# Altium project CANDLE-01.PrjPcb
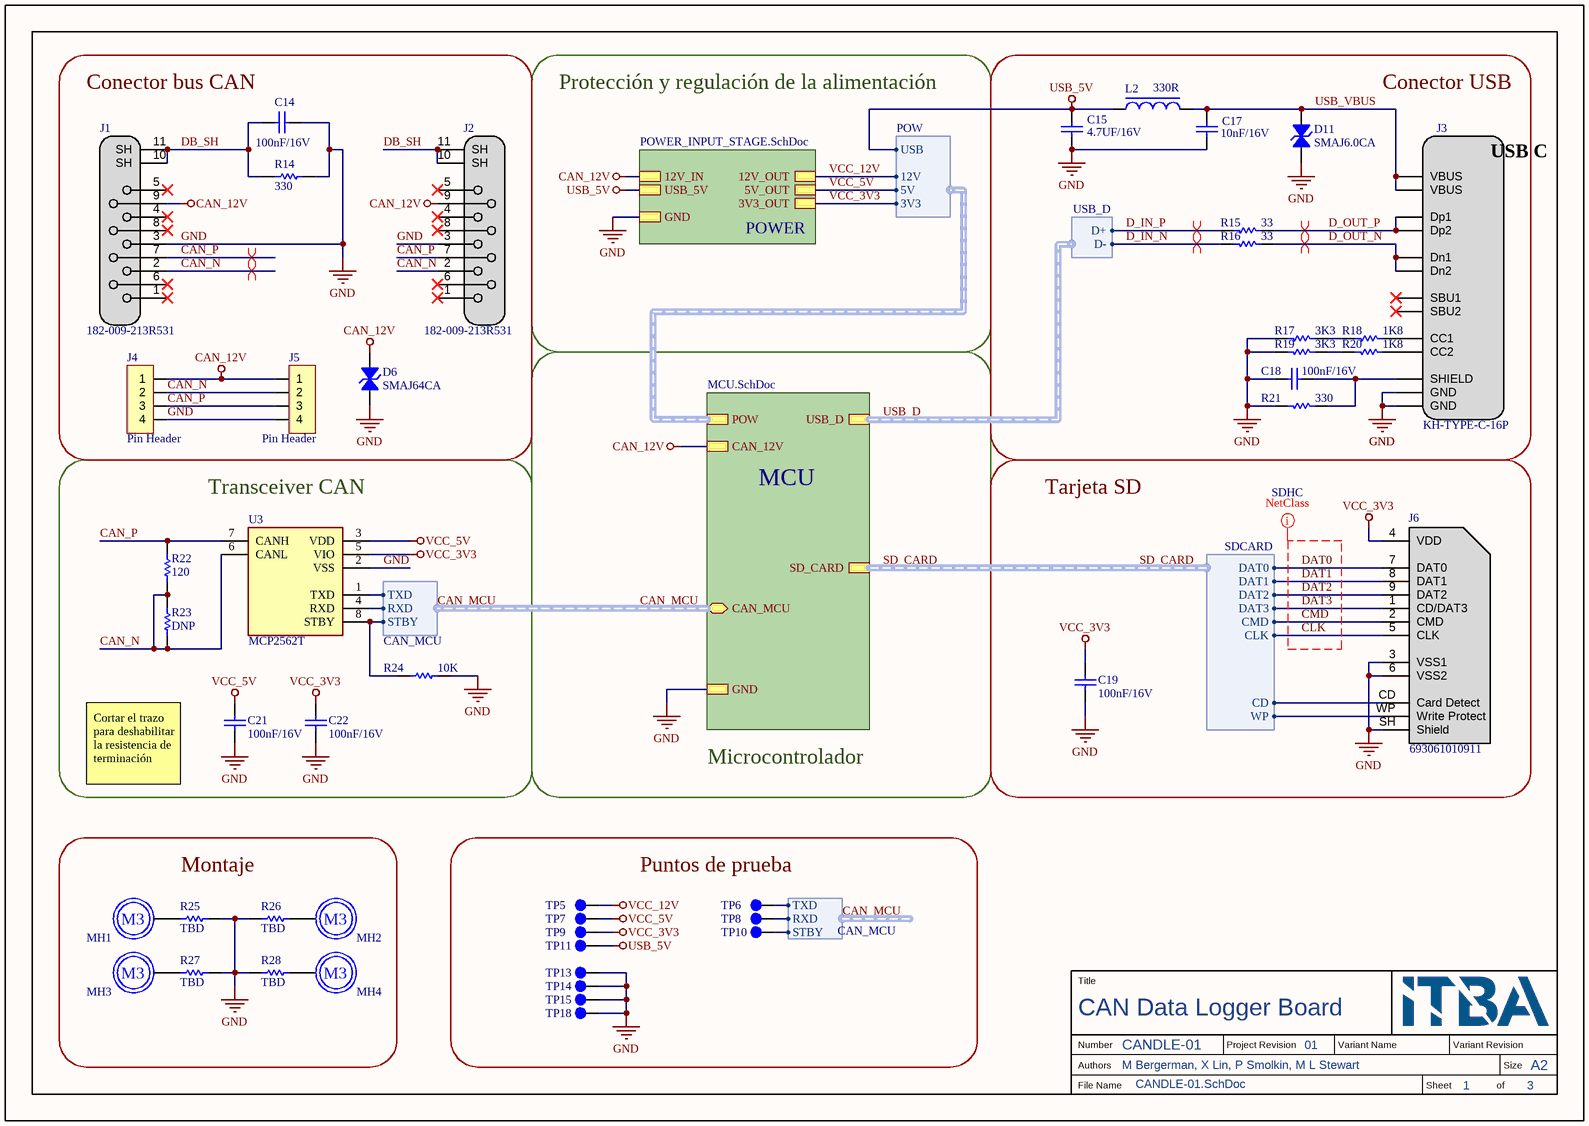
[diagram p0: CANDLE-01.SchDoc]
Authors: M Bergerman, X Lin, P Smolkin, M L Stewart; ProjectNumber: CANDLE-01; ProjectRevision: 01; ProjectTitle: CAN Data Logger Board
3 sheets, 134 parts. Net scope: strictly hierarchical (ports join the sheet entries above them; power ports are local).
Board file: CANDLE-01.PcbDoc
Sheets:
  CANDLE-01.SchDoc
    POWER = POWER_INPUT_STAGE.SchDoc
    MCU = MCU.SchDoc

## Sheet CANDLE-01.SchDoc
size 297 x 209 mm; SheetNumber: 1; SheetTotal: 3

### Parts
C14  100nF/16V  [CAP0805]
C15  4.7UF/16V  [CAP0805]
C17  10nF/16V  [CAP0805]
C18  100nF/16V  [CAP0805]
C19  100nF/16V  [CAP0805]
C21  100nF/16V  [CAP0805]
C22  100nF/16V  [CAP0805]
D6  SMAJ64CA  [DO-214AC]
D11  SMAJ6.0CA  [DO-214AC]
J1  182-009-213R531  [DE-9 - Female]
J2  182-009-213R531  [DE-9 - Female]
J3  KH-TYPE-C-16P  [USB4105-GF-A-060]
J4  Pin Header  [HEADER-4]
J5  Pin Header  [HEADER-4]
J6  693061010911  [SD CARD CONNECTOR]
L2  330R  [RES0805]
MH1  M3 Mount Hole  [M3_MOUNTING_HOLE]  (value not drawn)  (no BOM)
MH2  M3 Mount Hole  [M3_MOUNTING_HOLE]  (value not drawn)  (no BOM)
MH3  M3 Mount Hole  [M3_MOUNTING_HOLE]  (value not drawn)  (no BOM)
MH4  M3 Mount Hole  [M3_MOUNTING_HOLE]  (value not drawn)  (no BOM)
R14  330  [RES0805]
R15  33  [RES0805]
R16  33  [RES0805]
R17  3K3  [RES0805]
R18  1K8  [RES0805]
R19  3K3  [RES0805]
R20  1K8  [RES0805]
R21  330  [RES0805]
R22  120  [RES0805]
R23  DNP  [RES0805]  (no BOM)
R24  10K  [RES0805]
R25  TBD  [RES0805]
R26  TBD  [RES0805]
R27  TBD  [RES0805]
R28  TBD  [RES0805]
TP5  Testpoint  [TP_SMD_Ø1.0mm]  (value not drawn)  (no BOM)
TP6  Testpoint  [TP_SMD_Ø1.0mm]  (value not drawn)  (no BOM)
TP7  Testpoint  [TP_SMD_Ø1.0mm]  (value not drawn)  (no BOM)
TP8  Testpoint  [TP_SMD_Ø1.0mm]  (value not drawn)  (no BOM)
TP9  Testpoint  [TP_SMD_Ø1.0mm]  (value not drawn)  (no BOM)
TP10  Testpoint  [TP_SMD_Ø1.0mm]  (value not drawn)  (no BOM)
TP11  Testpoint  [TP_SMD_Ø1.0mm]  (value not drawn)  (no BOM)
TP13  Testpoint  [TP_SMD_Ø1.0mm]  (value not drawn)  (no BOM)
TP14  Testpoint  [TP_SMD_Ø1.0mm]  (value not drawn)  (no BOM)
TP15  Testpoint  [TP_SMD_Ø1.0mm]  (value not drawn)  (no BOM)
TP18  Testpoint  [TP_SMD_Ø1.0mm]  (value not drawn)  (no BOM)
U3  MCP2562T  [8-SOIC]

### Blocks framed on the sheet
Conector bus CAN: C14 D6 J1 J2 J4 J5 R14
Conector USB: C15 C17 C18 D11 J3 L2 R15-R21
Transceiver CAN: C21 C22 R22-R24 U3
Tarjeta SD: C19 J6
Montaje: MH1-MH4 R25-R28
Puntos de prueba: TP5-TP11 TP13-TP15 TP18

### Sub-sheets
MCU = MCU.SchDoc: USB_D (harness USB_D), SD_CARD (harness SDCARD), CAN_MCU (bidir, harness CAN_MCU), POW (harness POW), CAN_12V, GND
POWER = POWER_INPUT_STAGE.SchDoc: 12V_IN, GND, 12V_OUT, 5V_OUT, 3V3_OUT, USB_5V

### Harnesses
SDCARD: DAT0, DAT1, DAT2, DAT3, CMD, CLK, CD, WP
CAN_MCU: TXD, RXD, STBY
USB_D: D+, D-
POW: 12V, 5V, 3V3, USB

### Nets
CAN_12V: D6.2(A2) J1.9 J2.9 J4.1 J5.1 ; sheet POWER/12V_IN, sheet MCU/CAN_12V  [project net 12V_IN]
GND: C14.2 C15.1 C17.1 C18.2 C19.1 C21.1 C22.1 D6.1(A1) D11.1(A1) J1.3 J2.3 J3.A1B12(GND) J3.B1A12(GND) J4.4 J5.4 J6.3(VSS1) J6.6(VSS2) J6.SH(Shield) R14.2 R17.1 R19.1 R21.2 R24.1 R25.1 R26.2 R27.1 R28.2 TP13.1(TP) TP14.1(TP) TP15.1(TP) TP18.1(TP) U3.2(VSS) ; sheet POWER/GND, sheet MCU/GND
USB_5V: C15.2 L2.1 TP11.1(TP) ; sheet POWER/USB_5V, sheet MCU/POW.USB
VCC_3V3: C19.2 C22.2 J6.4(VDD) TP9.1(TP) U3.5(VIO) ; sheet POWER/3V3_OUT, sheet MCU/POW.3V3
VCC_5V: C21.2 TP7.1(TP) U3.3(VDD) ; sheet POWER/5V_OUT, sheet MCU/POW.5V
VCC_12V: TP5.1(TP) ; sheet POWER/12V_OUT, sheet MCU/POW.12V
CAN_MCU.RXD: TP8.1(TP) U3.4(RXD) ; sheet MCU/CAN_MCU.RXD
CAN_MCU.STBY: R24.2 TP10.1(TP) U3.8(STBY) ; sheet MCU/CAN_MCU.STBY
CAN_MCU.TXD: TP6.1(TP) U3.1(TXD) ; sheet MCU/CAN_MCU.TXD
CAN_N: J1.2 J2.2 J4.2 J5.2 R22.1 R23.1 R23.2 U3.6(CANL)
CAN_P: J1.7 J2.7 J4.3 J5.3 R22.2 U3.7(CANH)
CLK: J6.5(CLK) ; sheet MCU/SD_CARD.CLK
CMD: J6.2(CMD) ; sheet MCU/SD_CARD.CMD
D_IN_N: R16.1 ; sheet MCU/USB_D.D-
D_IN_P: R15.1 ; sheet MCU/USB_D.D+
D_OUT_N: J3.A7(Dn1) J3.B7(Dn2) R16.2
D_OUT_P: J3.A6(Dp1) J3.B6(Dp2) R15.2
DAT0: J6.7(DAT0) ; sheet MCU/SD_CARD.DAT0
DAT1: J6.8(DAT1) ; sheet MCU/SD_CARD.DAT1
DAT2: J6.9(DAT2) ; sheet MCU/SD_CARD.DAT2
DAT3: J6.1(CD/DAT3) ; sheet MCU/SD_CARD.DAT3
DB_SH: C14.1 J1.10(SH) J1.11(SH) J2.10(SH) J2.11(SH) R14.1
SD_CARD.CD: J6.CD(Card_Detect) ; sheet MCU/SD_CARD.CD
SD_CARD.WP: J6.WP(Write_Protect) ; sheet MCU/SD_CARD.WP
USB_VBUS: C17.2 D11.2(A2) J3.A4B9(VBUS) J3.B4A9(VBUS) L2.2
NetC18_1: C18.1 J3.SH(SHIELD) R21.1
NetJ3_A5: J3.A5(CC1) R18.2
NetJ3_B5: J3.B5(CC2) R20.2
NetMH1_1: MH1.1(TP) R25.2
NetMH2_1: MH2.1(TP) R26.1
NetMH3_1: MH3.1(TP) R27.2
NetMH4_1: MH4.1(TP) R28.1
NetR17_2: R17.2 R18.1
NetR19_2: R19.2 R20.1

Not connected (* = marked no-connect by the designer): J1 1* 4* 5* 6* 8*; J2 1* 4* 5* 6* 8*; J3 A8(SBU1)* B8(SBU2)*

### Buses and harness runs
harness CAN_MCU = sheet MCU/CAN_MCU
harness SD_CARD = sheet MCU/SD_CARD
harness USB_D = sheet MCU/USB_D

### Layout directives
differential pair; differential pair class CAN: CAN_N, CAN_P
differential pair; differential pair class USB: D_IN_N, D_IN_P, D_OUT_N, D_OUT_P
net class SDHC: CLK, CMD, DAT0, DAT1, DAT2, DAT3

### Notes on the sheet
- Protección y regulación de la alimentación
- Cortar el trazo para deshabilitar la resistencia de terminación
- Microcontrolador
- Title
- File Name
- Number
- Authors
- Project Revision
- Variant Name
- Sheet
- Variant Revision
- of
- Size
- A2
- (in symbol M3 Mount Hole) M3
- (in symbol USB4105-GF-A-060) USB C

### Library data of the parts
C14 C15 C17-C19 C21 C22 = Capacitor: SMD 0805 Capacitor
D6 D11 = Diode TVS: TVS Diode
J1 J2 = DE-09: Receptacle Assembly, 9 Position, Right Angle
J3 = USB4105-GF-A-060: USB Connector Type C SMT 12 Pin; Manufacturer: GCT; Manufacturer Part Number: USB4105-GF-A-060; Distributor Link: https://eu.mouser.com/ProductDetail/GCT/USB4105-GF-A-060?qs=QNEnbhJQKvY2mocwNJzgfA%3D%3D
J4 J5 = HEADER-4: Pin Header 4-pos
J6 = SD_CARD_READER: SD Card Reader
L2 = Ferrite Bead
MH1-MH4 = M3 Mount Hole: M3 Mounting Hole
R14-R28 = Resistor: SMD 0805 Resistor
U3 = MCP2562T: High-Speed CAN Transceiver

## Sheet POWER_INPUT_STAGE.SchDoc
size 297 x 209 mm; SheetNumber: 2; SheetTotal: 3; SPICEModelCacheWNYSDJRL: <root> / <DocumentId>WNYSDJRL</DocumentId> / </root>
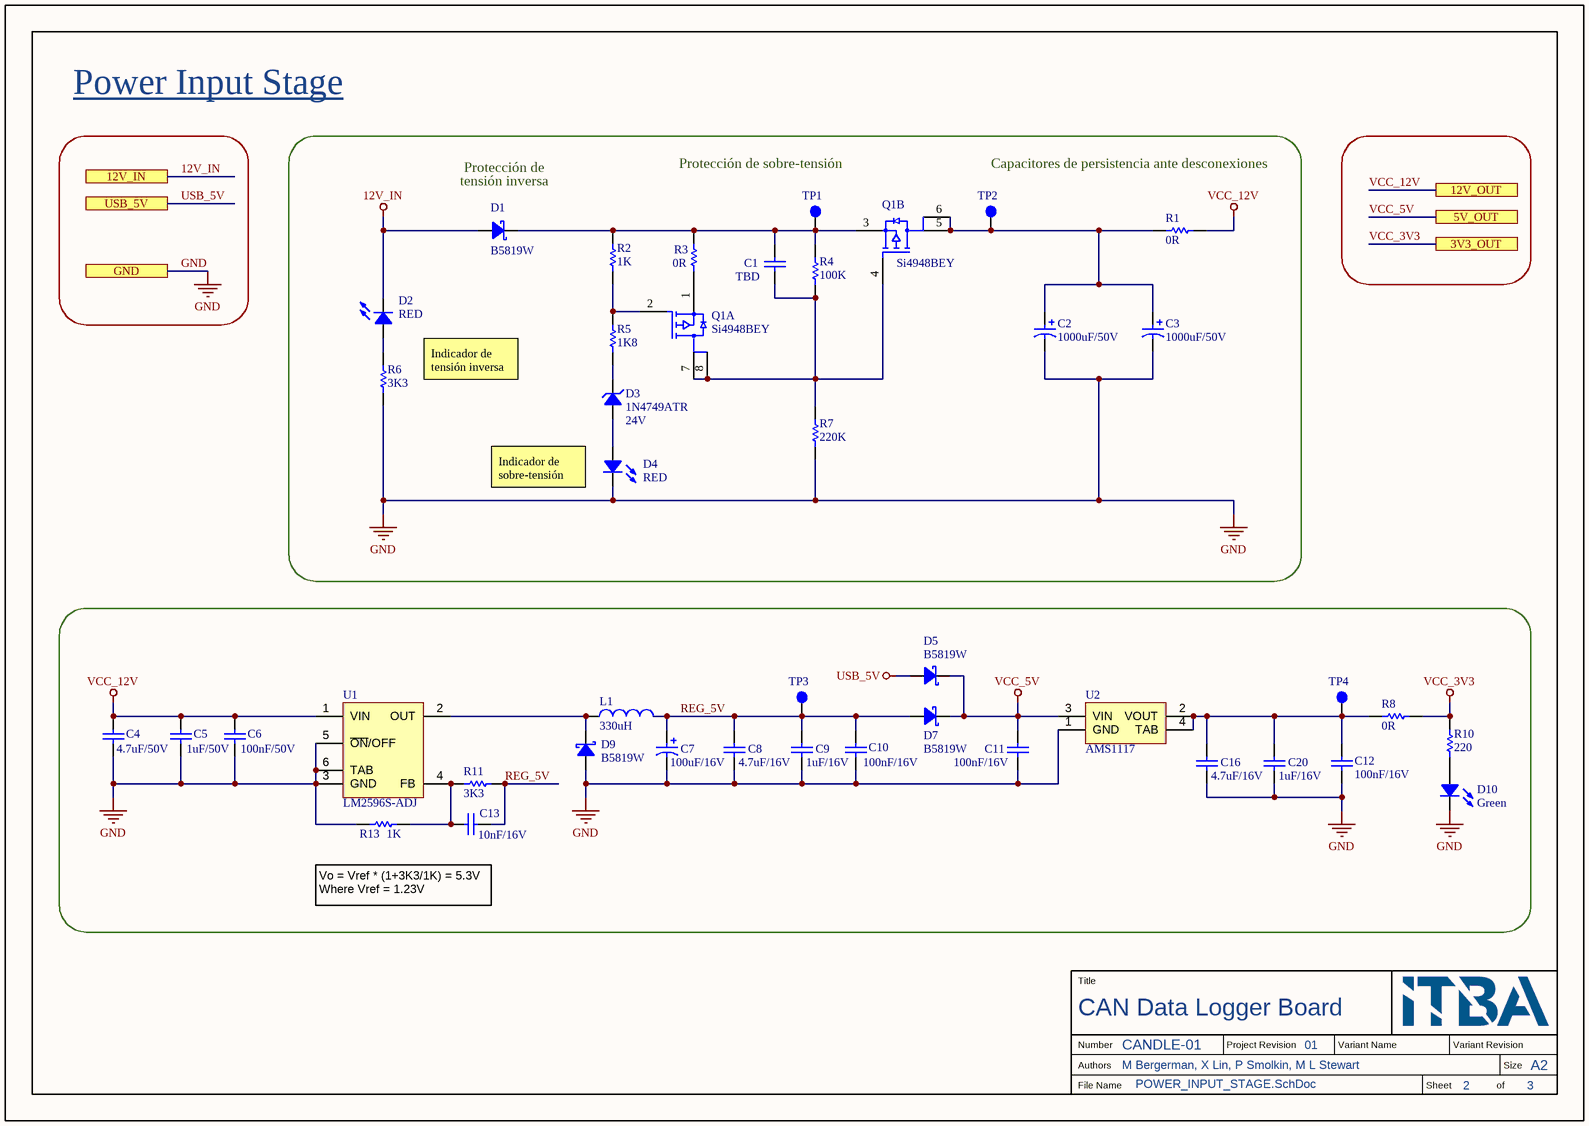
[diagram p1: POWER_INPUT_STAGE.SchDoc]

### Parts
C1  TBD  [CAP0805]
C2  1000uF/50V  [RAD-CAP-12.5/5mm]
C3  1000uF/50V  [RAD-CAP-12.5/5mm]
C4  4.7uF/50V  [CAP0805]
C5  1uF/50V  [CAP0805]
C6  100nF/50V  [CAP0805]
C7  100uF/16V  [RAD-CAP-12.5/5mm]
C8  4.7uF/16V  [CAP0805]
C9  1uF/16V  [CAP0805]
C10  100nF/16V  [CAP0805]
C11  100nF/16V  [CAP0805]
C12  100nF/16V  [CAP0805]
C13  10nF/16V  [CAP0805]
C16  4.7uF/16V  [CAP0805]
C20  1uF/16V  [CAP0805]
D1  B5819W  [SOD-123]
D2  RED  [LED-3MM-RED-RA]
D3  1N4749ATR  Voltage: 24V  [DO-35]
D4  RED  [LED-3MM-RED-RA]
D5  B5819W  [SOD-123]
D7  B5819W  [SOD-123]
D9  B5819W  [SOD-123]
D10  Green  [LED-3MM-GREEN-RA]
L1  330uH  [DRQ127-INDUCTOR]
Q1  Si4948BEY  [8-SOIC]  (parts A,B of 2)
R1  0R  [RES0805]
R2  1K  [RES0805]
R3  0R  [RES0805]
R4  100K  [RES0805]
R5  1K8  [RES0805]
R6  3K3  [RES0805]
R7  220K  [RES0805]
R8  0R  [RES0805]
R10  220  [RES0805]
R11  3K3  [RES0805]
R13  1K  [RES0805]
TP1  Testpoint  [TP_SMD_Ø1.0mm]  (value not drawn)  (no BOM)
TP2  Testpoint  [TP_SMD_Ø1.0mm]  (value not drawn)  (no BOM)
TP3  Testpoint  [TP_SMD_Ø1.0mm]  (value not drawn)  (no BOM)
TP4  Testpoint  [TP_SMD_Ø1.0mm]  (value not drawn)  (no BOM)
U1  LM2596S-ADJ  [LM2596S-ADJ/NOPB]
U2  AMS1117  [SOT223]

### Ports
3V3_OUT, 5V_OUT, 12V_IN, 12V_OUT, GND, USB_5V

### Nets
12V_IN: D1.1(A) D2.2(K) ; port 12V_IN
GND: C2.1 C3.1 C4.1 C5.1 C6.1 C7.1 C8.1 C9.1 C10.1 C11.1 C12.1 C16.1 C20.1 D4.2(K) D9.1(A) D10.2(K) R6.1 R7.1 R13.2 U1.3(GND) U1.5(~{ON}/OFF) U1.6(TAB) U2.1(GND) ; port GND
USB_5V: D5.1(A) ; port USB_5V
VCC_3V3: R8.2 R10.1 ; port 3V3_OUT
VCC_5V: C11.2 D5.2(K) D7.2(K) U2.3(VIN) ; port 5V_OUT
VCC_12V: C4.2 C5.2 C6.2 R1.2 U1.1(VIN) ; port 12V_OUT
REG_5V: C7.2 C8.2 C9.2 C10.2 C13.2 D7.1(A) L1.2 R11.1 TP3.1(TP)
NetC1_1: C1.1 Q1.4(G2) Q1.7(D1) Q1.8(D1) R4.1 R7.2
NetC1_2: C1.2 D1.2(K) Q1.3(S2) R2.2 R3.2 R4.2 TP1.1(TP)
NetC2_2: C2.2 C3.2 Q1.5(D2) Q1.6(D2) R1.1 TP2.1(TP)
NetC12_2: C12.2 C16.2 C20.2 R8.1 TP4.1(TP) U2.2(VOUT) U2.4(TAB)
NetC13_1: C13.1 R11.2 R13.1 U1.4(FB)
NetD2_1: D2.1(A) R6.2
NetD3_1: D3.1(K) R5.1
NetD3_2: D3.2(A) D4.1(A)
NetD9_2: D9.2(K) L1.1 U1.2(OUT)
NetD10_1: D10.1(A) R10.2
NetQ1_1: Q1.1(S1) R3.1
NetQ1_2: Q1.2(G1) R2.1 R5.2

### Notes on the sheet
- Power Input Stage
- Protección de
- (near D1) tensión inversa
- Protección de sobre-tensión
- Capacitores de persistencia ante desconexiones
- Indicador de tensión inversa
- (near D4) Indicador de sobre-tensión
- Vo = Vref * (1+3K3/1K) = 5.3V
  Where Vref = 1.23V
- Title
- File Name
- Number
- Authors
- Project Revision
- Variant Name
- Sheet
- Variant Revision
- of
- Size
- A2

### Library data of the parts
C1 C4-C6 C8-C13 C16 C20 = Capacitor: SMD 0805 Capacitor
C2 C3 C7 = Capacitor Polarized: Polarized Capacitor (Radial)
D1 D5 D7 D9 = Diode Schottky: Schottky Diode
D2 D4 = LED 3mm Red RA: Red 3mm LED
D3 = Diode Zener: Zener Diode
D10 = LED 3mm Green RA: Green 3mm LED
L1 = Inductor: Code_IEC: 1005; Published: 8-Jun-2000; LatestRevisionDate: 29-May-2009; LatestRevisionNote: IPC-7351 Footprint Added.; PackageReference: 0402-A; Publisher: Altium Limited; PackageDescription: Chip Inductor; Code_JEITA: 0402
Q1 = Si4948BEY: MOSFET 2P-CH 60V 2.4A 8-SOIC; Number of Elements: 2; Rise Time: 15ns; Turn-On Delay Time: 10ns; Turn-Off Delay Time: 50ns; Rds On Max: 120mR; Nominal Vgs: -3V; Polarity: P-CHANNEL; Max Power Dissipation: 1.4W; Element Configuration: Dual; Gate to Source Voltage (Vgs): 20V; Drain to Source Voltage (Vdss): -60V; Weight: 0.006596oz; Number of Pins: 8; Height: 1.55mm; Drain to Source Resistance: 120mR; Continuous Drain Current (ID): 2.4A; Packaging: Tape and Reel; On-State Resistance: 120mR; Fall Time: 15ns; Max Operating Temperature: 175°C; Drain-source On Resistance-Max: 120mR; Series: TrenchFET®; Radiation Hardening: No; Threshold Voltage: -3V; Lead Free: Lead Free; RoHS Compliant: Yes; Package Quantity: 2500; Power Dissipation: 1.4W; Min Operating Temperature: -55°C; Number of Channels: 2; Case/Package: SO; Reach SVHC Compliant: Yes; Width: 4mm; Length: 5mm; Mount: Surface Mount
R1-R8 R10 R11 R13 = Resistor: SMD 0805 Resistor
U1 = LM2596S-ADJ/NOPB: SIMPLE SWITCHER® Power Converter 150 KHz 3A Step-Down Voltage Regulator, 5-pin TO-263, Pb-Free
U2 = AMS1117: 1A LOW DROPOUT VOLTAGE REGULATOR

## Sheet MCU.SchDoc
size 297 x 209 mm; SheetNumber: 3; SheetTotal: 3; SPICEModelCacheVLKWCBOF: <root> / <DocumentId>VLKWCBOF</DocumentId> / </root>
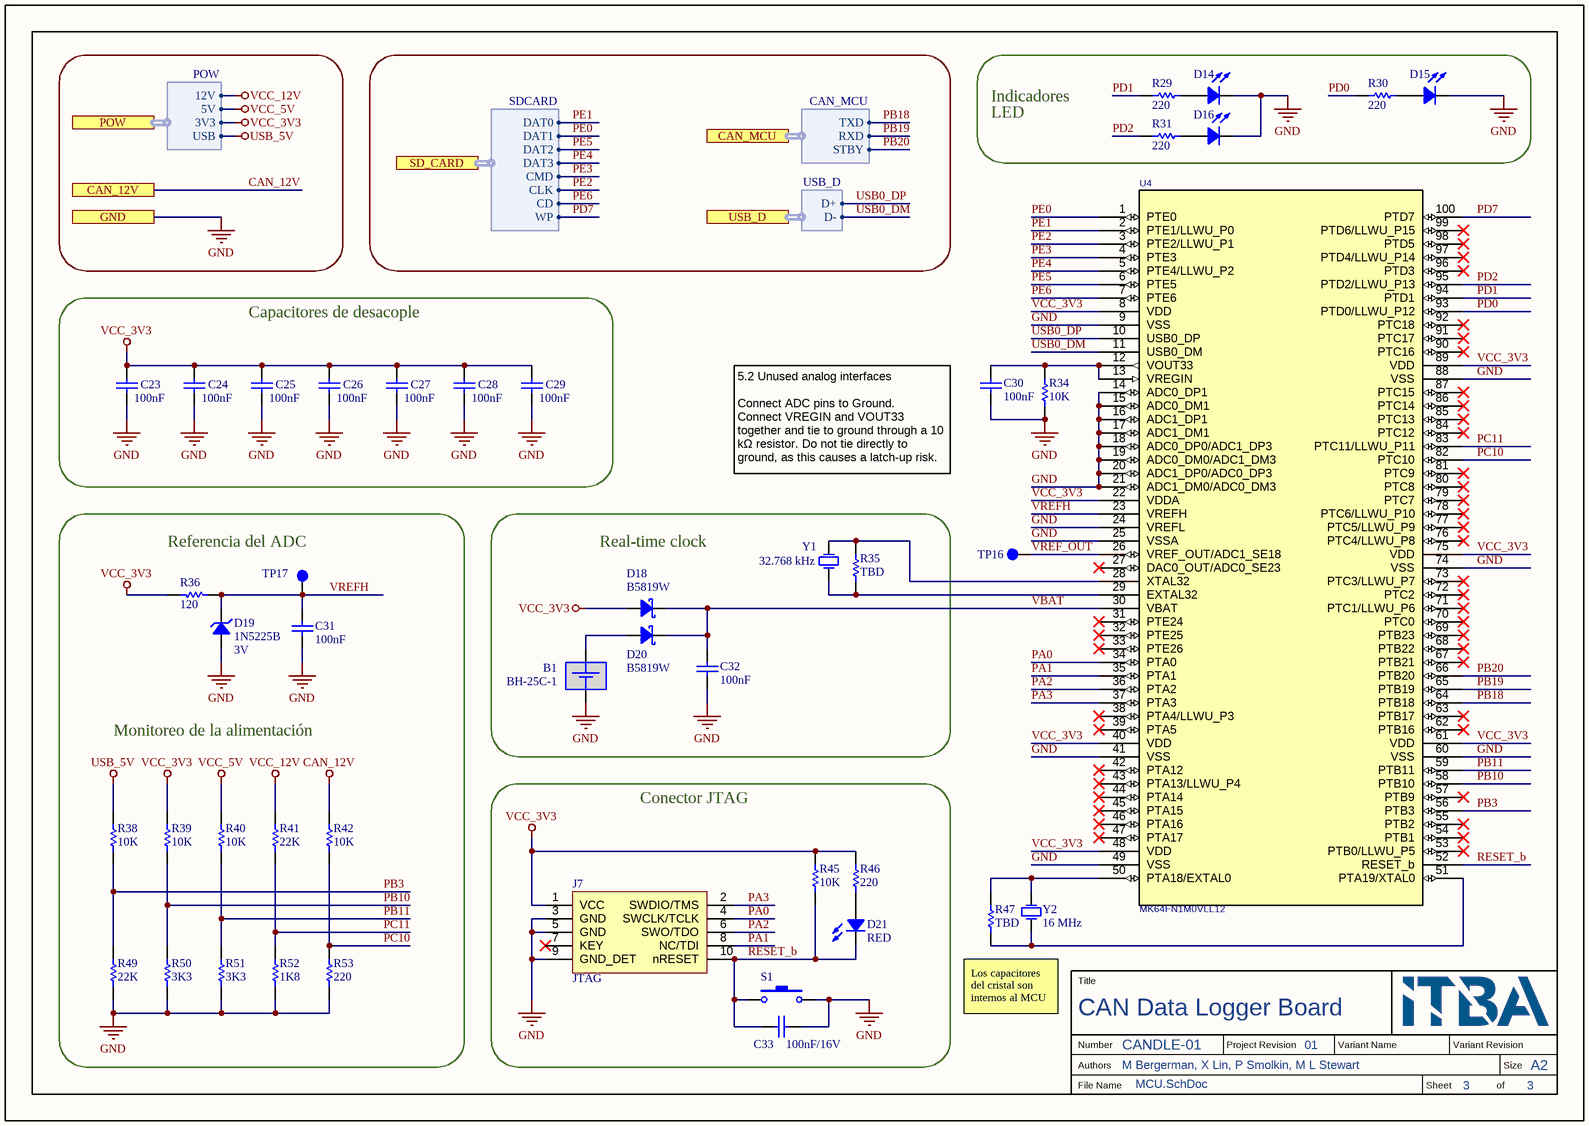
[diagram p2: MCU.SchDoc]

### Parts
B1  BH-25C-1  [COIN_CELL_HOLDER]
C23  100nF  [CAP0805]
C24  100nF  [CAP0805]
C25  100nF  [CAP0805]
C26  100nF  [CAP0805]
C27  100nF  [CAP0805]
C28  100nF  [CAP0805]
C29  100nF  [CAP0805]
C30  100nF  [CAP0805]
C31  100nF  [CAP0805]
C32  100nF  [CAP0805]
C33  100nF/16V  [CAP0805]
D14  RED  [LED-3MM-RED-RA]  (value not drawn)
D15  RED  [LED-3MM-RED-RA]  (value not drawn)
D16  RED  [LED-3MM-RED-RA]  (value not drawn)
D18  B5819W  [SOD-123]
D19  1N5225B  Voltage: 3V  [DO-35]
D20  B5819W  [SOD-123]
D21  RED  [LED-3MM-RED-RA]
J7  JTAG  [JTAG-10PIN]
R29  220  [RES0805]
R30  220  [RES0805]
R31  220  [RES0805]
R34  10K  [RES0805]
R35  TBD  [RES0805]
R36  120  [RES0805]
R38  10K  [RES0805]
R39  10K  [RES0805]
R40  10K  [RES0805]
R41  22K  [RES0805]
R42  10K  [RES0805]
R45  10K  [RES0805]
R46  220  [RES0805]
R47  TBD  [RES0805]
R49  22K  [RES0805]
R50  3K3  [RES0805]
R51  3K3  [RES0805]
R52  1K8  [RES0805]
R53  220  [RES0805]
S1  Tact Switch  [TACT SWITCH]  (value not drawn)
TP16  Testpoint  [TP_SMD_Ø1.0mm]  (value not drawn)  (no BOM)
TP17  Testpoint  [TP_SMD_Ø1.0mm]  (value not drawn)  (no BOM)
U4  MK64FN1M0VLL12  [QFP50P1600X1600X160-100N]
Y1  32.768 kHz  [XTAL-RAD-3X8]
Y2  16 MHz  [XTAL-HC-49S]

### Blocks framed on the sheet
Capacitores de desacople: C23-C29
Real-time clock: B1 C32 D18 D20 R35 Y1
Conector JTAG: C33 D21 J7 R45 R46 S1

### Ports
CAN_12V, CAN_MCU (harness CAN_MCU), GND, POW (harness POW), SD_CARD (harness SDCARD), USB_D (harness USB_D)

### Harnesses
CAN_MCU: TXD, RXD, STBY
USB_D: D+, D-
SDCARD: DAT0, DAT1, DAT2, DAT3, CMD, CLK, CD, WP
POW: 12V, 5V, 3V3, USB

### Nets
CAN_12V: R42.1 ; port CAN_12V  [project net 12V_IN]
GND: B1.2 C23.1 C24.1 C25.1 C26.1 C27.1 C28.1 C29.1 C30.1 C31.1 C32.1 C33.1 D14.2(K) D15.2(K) D16.2(K) D19.2(A) J7.3(GND) J7.5(GND) J7.9(GND_DET) R34.1 R49.2 R50.2 R51.2 R52.2 R53.2 S1.2 U4.9(VSS) U4.14(ADC0_DP1) U4.15(ADC0_DM1) U4.16(ADC1_DP1) U4.17(ADC1_DM1) U4.18(ADC0_DP0/ADC1_DP3) U4.19(ADC0_DM0/ADC1_DM3) U4.20(ADC1_DP0/ADC0_DP3) U4.21(ADC1_DM0/ADC0_DM3) U4.24(VREFL) U4.25(VSSA) U4.41(VSS) U4.49(VSS) U4.60(VSS) U4.74(VSS) U4.88(VSS) ; port GND
USB_5V: R38.1 ; port POW.USB
VCC_3V3: C23.2 C24.2 C25.2 C26.2 C27.2 C28.2 C29.2 D18.1(A) J7.1(VCC) R36.2 R39.1 R45.2 R46.1 U4.8(VDD) U4.22(VDDA) U4.40(VDD) U4.48(VDD) U4.61(VDD) U4.75(VDD) U4.89(VDD) ; port POW.3V3
VCC_5V: R40.1 ; port POW.5V
VCC_12V: R41.1 ; port POW.12V
PA0: J7.4(SWCLK/TCLK) U4.34(PTA0)
PA1: J7.8(NC/TDI) U4.35(PTA1)
PA2: J7.6(SWO/TDO) U4.36(PTA2)
PA3: J7.2(SWDIO/TMS) U4.37(PTA3)
PB3: R38.2 R49.1 U4.56(PTB3)
PB10: R39.2 R50.1 U4.58(PTB10)
PB11: R40.2 R51.1 U4.59(PTB11)
PB18: U4.64(PTB18) ; port CAN_MCU.TXD  [project net CAN_MCU.TXD]
PB19: U4.65(PTB19) ; port CAN_MCU.RXD  [project net CAN_MCU.RXD]
PB20: U4.66(PTB20) ; port CAN_MCU.STBY  [project net CAN_MCU.STBY]
PC10: R42.2 R53.1 U4.82(PTC10)
PC11: R41.2 R52.1 U4.83(PTC11/LLWU_P11)
PD0: R30.1 U4.93(PTD0/LLWU_P12)
PD1: R29.1 U4.94(PTD1)
PD2: R31.1 U4.95(PTD2/LLWU_P13)
PD7: U4.100(PTD7) ; port SD_CARD.WP  [project net SD_CARD.WP]
PE0: U4.1(PTE0) ; port SD_CARD.DAT1  [project net DAT1]
PE1: U4.2(PTE1/LLWU_P0) ; port SD_CARD.DAT0  [project net DAT0]
PE2: U4.3(PTE2/LLWU_P1) ; port SD_CARD.CLK  [project net CLK]
PE3: U4.4(PTE3) ; port SD_CARD.CMD  [project net CMD]
PE4: U4.5(PTE4/LLWU_P2) ; port SD_CARD.DAT3  [project net DAT3]
PE5: U4.6(PTE5) ; port SD_CARD.DAT2  [project net DAT2]
PE6: U4.7(PTE6) ; port SD_CARD.CD  [project net SD_CARD.CD]
RESET_b: C33.2 D21.2(K) J7.10(nRESET) R45.1 S1.1 U4.52(RESET_b)
USB0_DM: U4.11(USB0_DM) ; port USB_D.D-  [project net D_IN_N]
USB0_DP: U4.10(USB0_DP) ; port USB_D.D+  [project net D_IN_P]
VBAT: C32.2 D18.2(K) D20.2(K) U4.30(VBAT)
VREF_OUT: TP16.1(TP) U4.26(VREF_OUT/ADC1_SE18)
VREFH: C31.2 D19.1(K) R36.1 TP17.1(TP) U4.23(VREFH)
NetB1_1: B1.1 D20.1(A)
NetC30_2: C30.2 R34.2 U4.12(VOUT33) U4.13(VREGIN)
NetD14_1: D14.1(A) R29.2
NetD15_1: D15.1(A) R30.2
NetD16_1: D16.1(A) R31.2
NetD21_1: D21.1(A) R46.2
NetR35_1: R35.1 U4.28(XTAL32) Y1.2(OSC2)
NetR35_2: R35.2 U4.29(EXTAL32) Y1.1(OSC1)
NetR47_1: R47.1 U4.51(PTA19/XTAL0) Y2.1(OSC1)
NetR47_2: R47.2 U4.50(PTA18/EXTAL0) Y2.2(OSC2)

Not connected (* = marked no-connect by the designer): J7 7(KEY)*; U4 27(DAC0_OUT/ADC0_SE23)* 31(PTE24)* 32(PTE25)* 33(PTE26)* 38(PTA4/LLWU_P3)* 39(PTA5)* 42(PTA12)* 43(PTA13/LLWU_P4)* 44(PTA14)* 45(PTA15)* 46(PTA16)* 47(PTA17)* 53(PTB0/LLWU_P5)* 54(PTB1)* 55(PTB2)* 57(PTB9)* 62(PTB16)* 63(PTB17)* 67(PTB21)* 68(PTB22)* 69(PTB23)* 70(PTC0)* 71(PTC1/LLWU_P6)* 72(PTC2)* 73(PTC3/LLWU_P7)* 76(PTC4/LLWU_P8)* 77(PTC5/LLWU_P9)* 78(PTC6/LLWU_P10)* 79(PTC7)* 80(PTC8)* 81(PTC9)* 84(PTC12)* 85(PTC13)* 86(PTC14)* 87(PTC15)* 90(PTC16)* 91(PTC17)* 92(PTC18)* 96(PTD3)* 97(PTD4/LLWU_P14)* 98(PTD5)* 99(PTD6/LLWU_P15)*

### Notes on the sheet
- LED
- Indicadores
- (near C30) 5.2 Unused analog interfaces
  Connect ADC pins to Ground.
  Connect VREGIN and VOUT33 together and tie to ground through a 10 kΩ resistor. Do not tie directly to ground, as this causes a latch-up risk.
- Referencia del ADC
- Monitoreo de la alimentación
- Los capacitores del cristal son internos al MCU
- Title
- File Name
- Number
- Authors
- Project Revision
- Variant Name
- Sheet
- Variant Revision
- of
- Size
- A2

### Library data of the parts
B1 = Battery Holder
C23-C33 = Capacitor: SMD 0805 Capacitor
D14-D16 D21 = LED 3mm Red RA: Red 3mm LED
D18 D20 = Diode Schottky: Schottky Diode
D19 = Diode Zener: Zener Diode
J7 = JTAG Header
R29-R31 R34-R36 R38-R42 R45-R47 R49-R53 = Resistor: SMD 0805 Resistor
S1 = Tactile Switch: 2-pin 6mm tactile switch (push-button); Published: 24-Mar-1999; LatestRevisionDate: 17-Jul-2002; LatestRevisionNote: Re-released for DXP Platform.; PackageReference: SPST-2; Publisher: Altium Limited; PackageDescription: Switch; 2 Leads
U4 = MK64FN1M0VLL12_1: 120 MHz ARM Cortex®-M4-based Microcontroller with FPU; FP_DESC: LQFP100; MFG: NXP; Footprint Checked: Assign OK, Footprint OK; MFG_PN: MK64FN1M0VLL12
Y1 = Crystal 32.768 kHz: Crystal Oscillator - Radial 3x8mm
Y2 = Crystal 16 MHz: Crystal Oscillator HS-49S; Published: 8-Jun-2000; LatestRevisionDate: 17-Jul-2002; LatestRevisionNote: Re-released for DXP Platform.; PackageReference: R38; Publisher: Altium Limited; PackageDescription: Crystal, Thru-Hole; 2 Leads; Body 3.1 x 8.2 mm (Dia.xH)

## Nets that join several sheets
12V_IN: CANDLE-01 (5 pins), POWER_INPUT_STAGE (D1.1 D2.2), MCU (R42.1)
GND: CANDLE-01 (32 pins), POWER_INPUT_STAGE (23 pins), MCU (42 pins)
USB_5V: CANDLE-01 (C15.2 L2.1 TP11.1), POWER_INPUT_STAGE (D5.1), MCU (R38.1)
VCC_3V3: CANDLE-01 (5 pins), POWER_INPUT_STAGE (R8.2 R10.1), MCU (20 pins)
VCC_5V: CANDLE-01 (C21.2 TP7.1 U3.3), POWER_INPUT_STAGE (C11.2 D5.2 D7.2 U2.3), MCU (R40.1)
VCC_12V: CANDLE-01 (TP5.1), POWER_INPUT_STAGE (5 pins), MCU (R41.1)
CAN_MCU.RXD: CANDLE-01 (TP8.1 U3.4), MCU (U4.65)
CAN_MCU.STBY: CANDLE-01 (R24.2 TP10.1 U3.8), MCU (U4.66)
CAN_MCU.TXD: CANDLE-01 (TP6.1 U3.1), MCU (U4.64)
CLK: CANDLE-01 (J6.5), MCU (U4.3)
CMD: CANDLE-01 (J6.2), MCU (U4.4)
D_IN_N: CANDLE-01 (R16.1), MCU (U4.11)
D_IN_P: CANDLE-01 (R15.1), MCU (U4.10)
DAT0: CANDLE-01 (J6.7), MCU (U4.2)
DAT1: CANDLE-01 (J6.8), MCU (U4.1)
DAT2: CANDLE-01 (J6.9), MCU (U4.6)
DAT3: CANDLE-01 (J6.1), MCU (U4.5)
SD_CARD.CD: CANDLE-01 (J6.CD), MCU (U4.7)
SD_CARD.WP: CANDLE-01 (J6.WP), MCU (U4.100)

## Assembly variants
MC: all parts fitted